# Altium schematic sheet Power.SchDoc
size A4; SheetNumber: 1; SheetTotal: 1
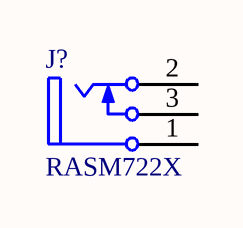
[diagram p0: Power.SchDoc]

## Parts
J?  RASM722X  [SWIT-RASM722X_V]

## Nets

Not connected (* = marked no-connect by the designer): J? 1(SLEEVE) 2(TIP) 3(SHUNT)

## Library data of the parts
J? = CMP-002-00013-2: Power Jack, 5 A, 250 V, 3-Pin SMD, RoHS, Bulk; Manufacturer: Switchcraft; Connector Type: DCJack; Package Reference: RASM722X; Mounting Technology: SM; Manufacturer URL: http://www.switchcraft.com/; Datasheet URL: http://www.switchcraft.com/Drawings/rasm732x_cd.pdf; RoHS Compliant: Unknown; Datasheet Version: Rev. A, 09/2005; Package Description: 3-Pin Surface Mount Device, Body 14.5 x 9 mm; Case/Package: RASM722X